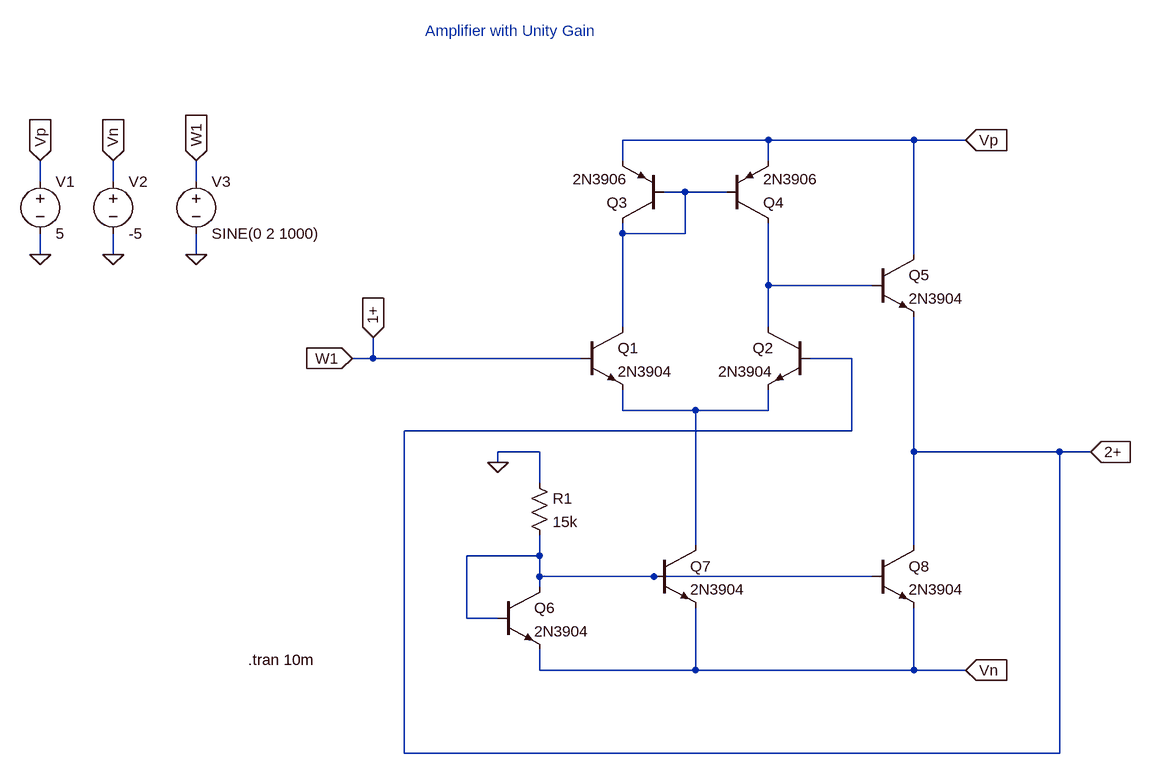
[diagram p0: schematic unity_gain_amp.asc]
unity_gain_amp.asc, the LTspice schematic file:
Version 4
SHEET 1 1088 680
WIRE 352 -384 128 -384
WIRE 576 -384 352 -384
WIRE 656 -384 576 -384
WIRE 128 -352 128 -384
WIRE 352 -352 352 -384
WIRE -768 -320 -768 -352
WIRE -656 -320 -656 -352
WIRE -528 -320 -528 -352
WIRE 224 -304 192 -304
WIRE 288 -304 224 -304
WIRE 128 -240 128 -256
WIRE 224 -240 224 -304
WIRE 224 -240 128 -240
WIRE -768 -208 -768 -240
WIRE -656 -208 -656 -240
WIRE -528 -208 -528 -240
WIRE 576 -208 576 -384
WIRE 352 -160 352 -256
WIRE 512 -160 352 -160
WIRE 128 -96 128 -240
WIRE 352 -96 352 -160
WIRE -256 -48 -256 -80
WIRE -256 -48 -288 -48
WIRE 64 -48 -256 -48
WIRE 480 -48 416 -48
WIRE 128 32 128 0
WIRE 240 32 128 32
WIRE 352 32 352 0
WIRE 352 32 240 32
WIRE 480 64 480 -48
WIRE 480 64 -208 64
WIRE 0 96 -64 96
WIRE 576 96 576 -112
WIRE 800 96 576 96
WIRE 848 96 800 96
WIRE -64 112 -64 96
WIRE 0 144 0 96
WIRE 240 240 240 32
WIRE 576 240 576 96
WIRE 0 256 0 224
WIRE 0 256 -112 256
WIRE 0 288 0 256
WIRE 176 288 0 288
WIRE 512 288 176 288
WIRE 0 304 0 288
WIRE -112 352 -112 256
WIRE -64 352 -112 352
WIRE 0 432 0 400
WIRE 240 432 240 336
WIRE 240 432 0 432
WIRE 576 432 576 336
WIRE 576 432 240 432
WIRE 656 432 576 432
WIRE -208 560 -208 64
WIRE 800 560 800 96
WIRE 800 560 -208 560
FLAG -64 112 0
FLAG -288 -48 W1
IOPIN -288 -48 In
FLAG -256 -80 1+
IOPIN -256 -80 In
FLAG 656 -384 Vp
IOPIN 656 -384 In
FLAG 656 432 Vn
IOPIN 656 432 In
FLAG 848 96 2+
IOPIN 848 96 In
FLAG -768 -208 0
FLAG -656 -208 0
FLAG -528 -208 0
FLAG -768 -352 Vp
IOPIN -768 -352 In
FLAG -656 -352 Vn
IOPIN -656 -352 In
FLAG -528 -352 W1
IOPIN -528 -352 In
SYMBOL npn 64 -96 R0
SYMATTR InstName Q1
SYMATTR Value 2N3904
SYMBOL npn 416 -96 M0
SYMATTR InstName Q2
SYMATTR Value 2N3904
SYMBOL pnp 192 -256 R180
SYMATTR InstName Q3
SYMATTR Value 2N3906
SYMBOL pnp 288 -256 M180
SYMATTR InstName Q4
SYMATTR Value 2N3906
SYMBOL npn 512 -208 R0
SYMATTR InstName Q5
SYMATTR Value 2N3904
SYMBOL npn -64 304 R0
SYMATTR InstName Q6
SYMATTR Value 2N3904
SYMBOL npn 176 240 R0
SYMATTR InstName Q7
SYMATTR Value 2N3904
SYMBOL npn 512 240 R0
SYMATTR InstName Q8
SYMATTR Value 2N3904
SYMBOL res -16 128 R0
SYMATTR InstName R1
SYMATTR Value 15k
SYMBOL voltage -768 -336 R0
WINDOW 123 0 0 Left 0
WINDOW 39 0 0 Left 0
SYMATTR InstName V1
SYMATTR Value 5
SYMBOL voltage -656 -336 R0
WINDOW 123 0 0 Left 0
WINDOW 39 0 0 Left 0
SYMATTR InstName V2
SYMATTR Value -5
SYMBOL voltage -528 -336 R0
WINDOW 123 0 0 Left 0
WINDOW 39 0 0 Left 0
SYMATTR InstName V3
SYMATTR Value SINE(0 2 1000)
TEXT -176 -552 Left 2 ;Amplifier with Unity Gain
TEXT -448 416 Left 2 !.tran 10m

The netlist it stands for:
* unity_gain_amp.asc
Q1 N001 1+ N003 0 2N3904
Q2 N002 2+ N003 0 2N3904
Q3 N001 N001 Vp 0 2N3906
Q4 N002 N001 Vp 0 2N3906
Q5 Vp N002 2+ 0 2N3904
Q6 N004 N004 Vn 0 2N3904
Q7 N003 N004 Vn 0 2N3904
Q8 2+ N004 Vn 0 2N3904
R1 0 N004 15k
V1 Vp 0 5
V2 Vn 0 -5
V3 1+ 0 SINE(0 2 1000)
.model NPN NPN
.model PNP PNP
.lib standard.bjt
* Amplifier with Unity Gain
.tran 10m
.backanno
.end